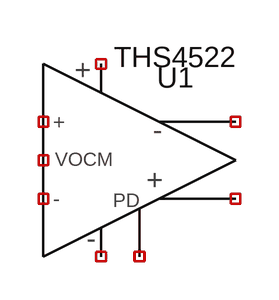
[diagram p0: schematic Draft1.asc]
Draft1.asc, the LTspice schematic file:
Version 4.1
SHEET 1 880 680
SYMBOL THS4522 240 160 R0
SYMATTR InstName U1

The netlist it stands for:
* Draft1.asc
X§U1 NC_01 NC_02 NC_03 NC_04 NC_05 NC_06 NC_07 NC_08 THS4522  ; pins ? ? ? - + ? ? ?
.lib C:\Users\owend\Desktop\Projects\LCR\simulation\models\THS4522.txt
.backanno
.end